# Altium schematic sheet CPU-0.SchDoc
size A3
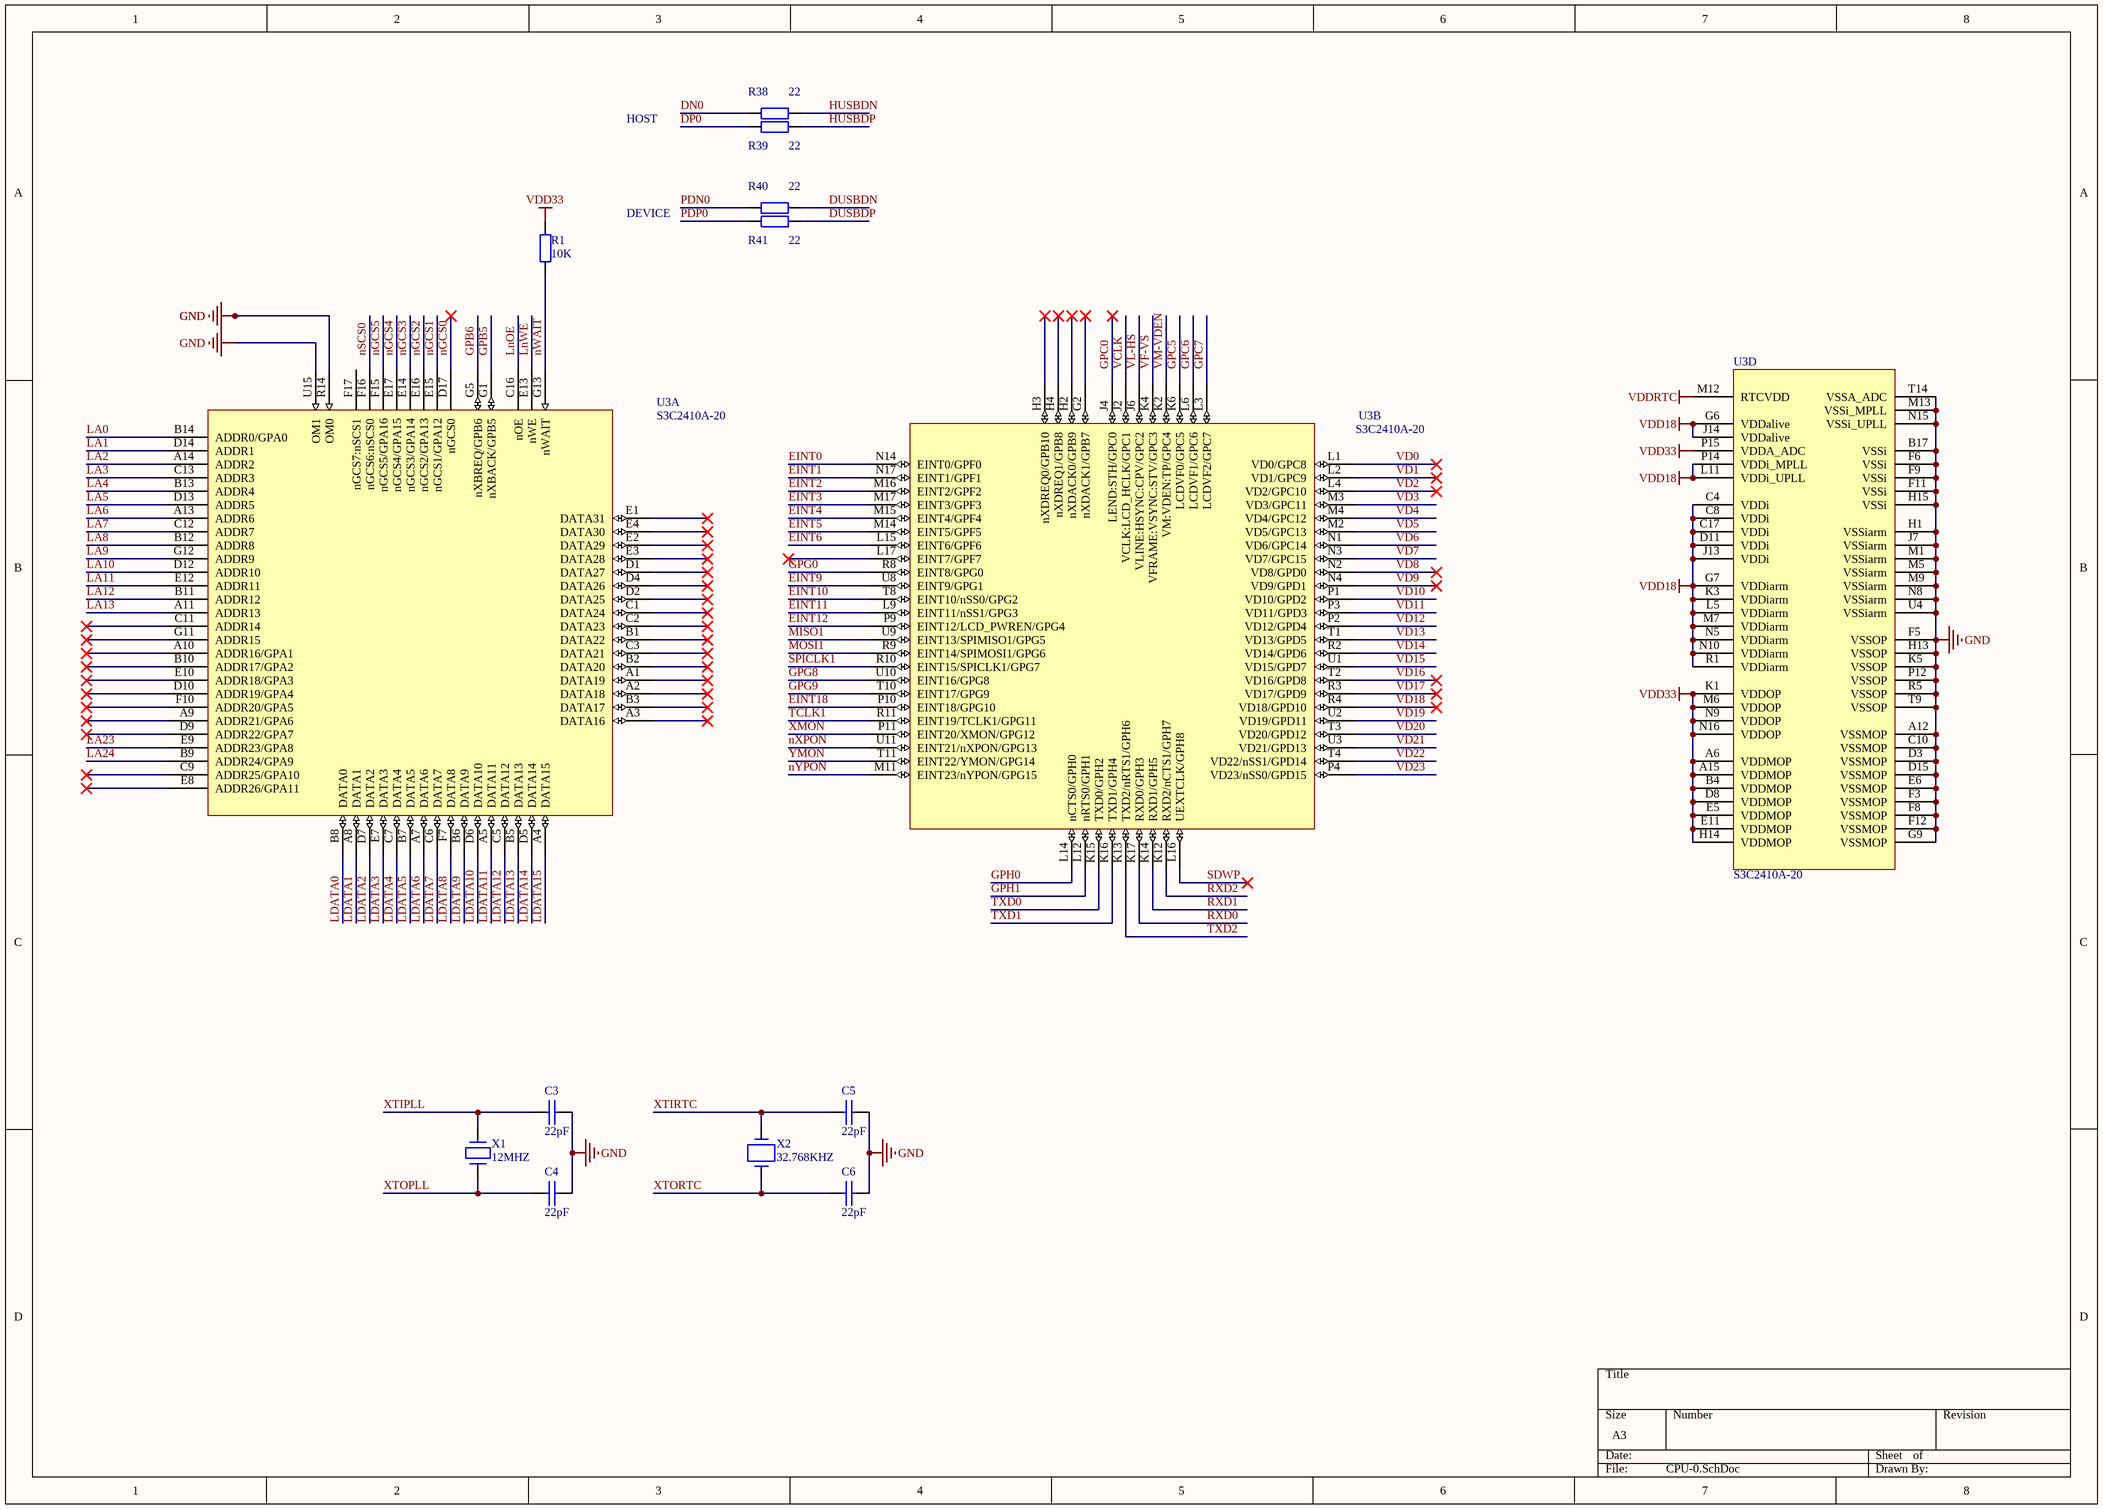
[diagram p0: CPU-0.SchDoc]

## Parts
C3  22pF  [A型钽电容]
C4  22pF  [A型钽电容]
C5  22pF  [A型钽电容]
C6  22pF  [A型钽电容]
R1  value 10K  [0603R]  (hidden comment: Res2)
R38  value 22  [0603R]  (hidden comment: Res2)
R39  value 22  [0603R]  (hidden comment: Res2)
R40  value 22  [0603R]  (hidden comment: Res2)
R41  value 22  [0603R]  (hidden comment: Res2)
U3  S3C2410A-20  [FBGA272]  (parts A,B,D of 4)
X1  12MHZ  [OSC2PR-1]
X2  32.768KHZ  [XTAL-B]

## Nets
GND: C3.2 C4.2 C5.2 C6.2 U3.A12(VSSMOP) U3.B17(VSSi) U3.C10(VSSMOP) U3.D3(VSSMOP) U3.D15(VSSMOP) U3.E6(VSSMOP) U3.F3(VSSMOP) U3.F5(VSSOP) U3.F6(VSSi) U3.F8(VSSMOP) U3.F9(VSSi) U3.F11(VSSi) U3.F12(VSSMOP) U3.G9(VSSMOP) U3.H1(VSSiarm) U3.H13(VSSOP) U3.H15(VSSi) U3.J7(VSSiarm) U3.K5(VSSOP) U3.M1(VSSiarm) U3.M5(VSSiarm) U3.M9(VSSiarm) U3.M13(VSSi_MPLL) U3.N8(VSSiarm) U3.N15(VSSi_UPLL) U3.P12(VSSOP) U3.R5(VSSOP) U3.R14(OM0) U3.T9(VSSOP) U3.T14(VSSA_ADC) U3.U4(VSSiarm) U3.U15(OM1)
VDD18: U3.C4(VDDi) U3.C8(VDDi) U3.C17(VDDi) U3.D11(VDDi) U3.G6(VDDalive) U3.G7(VDDiarm) U3.J13(VDDi) U3.J14(VDDalive) U3.K3(VDDiarm) U3.L5(VDDiarm) U3.L11(VDDi_UPLL) U3.M7(VDDiarm) U3.N5(VDDiarm) U3.N10(VDDiarm) U3.P14(VDDi_MPLL) U3.R1(VDDiarm)
VDD33: R1.2 U3.A6(VDDMOP) U3.A15(VDDMOP) U3.B4(VDDMOP) U3.D8(VDDMOP) U3.E5(VDDMOP) U3.E11(VDDMOP) U3.H14(VDDMOP) U3.K1(VDDOP) U3.M6(VDDOP) U3.N9(VDDOP) U3.N16(VDDOP) U3.P15(VDDA_ADC)
VDDRTC: U3.M12(RTCVDD)
DN0: R38.1
DP0: R39.1
DUSBDN: R40.2
DUSBDP: R41.2
EINT0: U3.N14(EINT0/GPF0)
EINT1: U3.N17(EINT1/GPF1)
EINT2: U3.M16(EINT2/GPF2)
EINT3: U3.M17(EINT3/GPF3)
EINT4: U3.M15(EINT4/GPF4)
EINT5: U3.M14(EINT5/GPF5)
EINT6: U3.L15(EINT6/GPF6)
EINT9: U3.U8(EINT9/GPG1)
EINT10: U3.T8(EINT10/nSS0/GPG2)
EINT11: U3.L9(EINT11/nSS1/GPG3)
EINT12: U3.P9(EINT12/LCD_PWREN/GPG4)
EINT18: U3.P10(EINT18/GPG10)
GPB5: U3.G1(nXBACK/GPB5)
GPB6: U3.G5(nXBREQ/GPB6)
GPC0: U3.J4(LEND:STH/GPC0)
GPC5: U3.K6(LCDVF0/GPC5)
GPC6: U3.L6(LCDVF1/GPC6)
GPC7: U3.L3(LCDVF2/GPC7)
GPG0: U3.R8(EINT8/GPG0)
GPG8: U3.U10(EINT16/GPG8)
GPG9: U3.T10(EINT17/GPG9)
GPH0: U3.L14(nCTS0/GPH0)
GPH1: U3.L12(nRTS0/GPH1)
HUSBDN: R38.2
HUSBDP: R39.2
LA0: U3.B14(ADDR0/GPA0)
LA1: U3.D14(ADDR1)
LA2: U3.A14(ADDR2)
LA3: U3.C13(ADDR3)
LA4: U3.B13(ADDR4)
LA5: U3.D13(ADDR5)
LA6: U3.A13(ADDR6)
LA7: U3.C12(ADDR7)
LA8: U3.B12(ADDR8)
LA9: U3.G12(ADDR9)
LA10: U3.D12(ADDR10)
LA11: U3.E12(ADDR11)
LA12: U3.B11(ADDR12)
LA13: U3.A11(ADDR13)
LA23: U3.E9(ADDR23/GPA8)
LA24: U3.B9(ADDR24/GPA9)
LDATA0: U3.B8(DATA0)
LDATA1: U3.A8(DATA1)
LDATA2: U3.D7(DATA2)
LDATA3: U3.E7(DATA3)
LDATA4: U3.C7(DATA4)
LDATA5: U3.B7(DATA5)
LDATA6: U3.A7(DATA6)
LDATA7: U3.C6(DATA7)
LDATA8: U3.F7(DATA8)
LDATA9: U3.B6(DATA9)
LDATA10: U3.D6(DATA10)
LDATA11: U3.A5(DATA11)
LDATA12: U3.C5(DATA12)
LDATA13: U3.B5(DATA13)
LDATA14: U3.D5(DATA14)
LDATA15: U3.A4(DATA15)
LnOE: U3.C16(nOE)
LnWE: U3.E13(nWE)
MISO1: U3.U9(EINT13/SPIMISO1/GPG5)
MOSI1: U3.R9(EINT14/SPIMOSI1/GPG6)
nGCS0: U3.D17(nGCS0)
nGCS1: U3.E15(nGCS1/GPA12)
nGCS2: U3.E16(nGCS2/GPA13)
nGCS3: U3.E14(nGCS3/GPA14)
nGCS4: U3.E17(nGCS4/GPA15)
nGCS5: U3.F15(nGCS5/GPA16)
nSCS0: U3.F16(nGCS6:nSCS0)
nWAIT: R1.1 U3.G13(nWAIT)
nXPON: U3.U11(EINT21/nXPON/GPG13)
nYPON: U3.M11(EINT23/nYPON/GPG15)
PDN0: R40.1
PDP0: R41.1
RXD0: U3.K17(RXD0/GPH3)
RXD1: U3.K14(RXD1/GPH5)
RXD2: U3.K12(RXD2/nCTS1/GPH7)
SDWP: U3.L16(UEXTCLK/GPH8)
SPICLK1: U3.R10(EINT15/SPICLK1/GPG7)
TCLK1: U3.R11(EINT19/TCLK1/GPG11)
TXD0: U3.K15(TXD0/GPH2)
TXD1: U3.K16(TXD1/GPH4)
TXD2: U3.K13(TXD2/nRTS1/GPH6)
VCLK: U3.J2(VCLK:LCD_HCLK/GPC1)
VD0: U3.L1(VD0/GPC8)
VD1: U3.L2(VD1/GPC9)
VD2: U3.L4(VD2/GPC10)
VD3: U3.M3(VD3/GPC11)
VD4: U3.M4(VD4/GPC12)
VD5: U3.M2(VD5/GPC13)
VD6: U3.N1(VD6/GPC14)
VD7: U3.N3(VD7/GPC15)
VD8: U3.N2(VD8/GPD0)
VD9: U3.N4(VD9/GPD1)
VD10: U3.P1(VD10/GPD2)
VD11: U3.P3(VD11/GPD3)
VD12: U3.P2(VD12/GPD4)
VD13: U3.T1(VD13/GPD5)
VD14: U3.R2(VD14/GPD6)
VD15: U3.U1(VD15/GPD7)
VD16: U3.T2(VD16/GPD8)
VD17: U3.R3(VD17/GPD9)
VD18: U3.R4(VD18/GPD10)
VD19: U3.U2(VD19/GPD11)
VD20: U3.T3(VD20/GPD12)
VD21: U3.U3(VD21/GPD13)
VD22: U3.T4(VD22/nSS1/GPD14)
VD23: U3.P4(VD23/nSS0/GPD15)
VF-VS: U3.K4(VFRAME:VSYNC:STV/GPC3)
VL-HS: U3.J6(VLINE:HSYNC:CPV/GPC2)
VM-VDEN: U3.K2(VM:VDEN:TP/GPC4)
XMON: U3.P11(EINT20/XMON/GPG12)
XTIPLL: C3.1 X1.2
XTIRTC: C5.1 X2.2
XTOPLL: C4.1 X1.1
XTORTC: C6.1 X2.1
YMON: U3.T11(EINT22/YMON/GPG14)

Not connected (* = marked no-connect by the designer): U3 A1(DATA19)* A2(DATA18)* A3(DATA16)* A9(ADDR21/GPA6)* A10(ADDR16/GPA1)* B1(DATA22)* B2(DATA20)* B3(DATA17)* B10(ADDR17/GPA2)* C1(DATA24)* C2(DATA23)* C3(DATA21)* C9(ADDR25/GPA10)* C11(ADDR14)* D1(DATA27)* D2(DATA25)* D4(DATA26)* D9(ADDR22/GPA7)* D10(ADDR19/GPA4)* E1(DATA31)* E2(DATA29)* E3(DATA28)* E4(DATA30)* E8(ADDR26/GPA11)* E10(ADDR18/GPA3)* F10(ADDR20/GPA5)* F17(nGCS7:nSCS1) G2(nXDACK1/GPB7)* G11(ADDR15)* H2(nXDACK0/GPB9)* H3(nXDREQ0/GPB10)* H4(nXDREQ1/GPB8)* L17(EINT7/GPF7)*

## Notes on the sheet
- HOST
- DEVICE

## Library data of the parts
C3-C6 = CAP_1: Capacitor
R1 R38-R41 = Res2_1: Resistor; Published: 8-Jun-2000; LatestRevisionDate: 17-Jul-2002; LatestRevisionNote: Re-released for DXP Platform.; PackageReference: AXIAL-0.4; Publisher: Altium Limited
U3 = S3C2410A-20: 32-Bit RISC Microprocessor, 200 MHz, 1.8V (Core), 3.3V (Memory and IO), 272-Pin FBGA; Published: 6-Oct-2005; LatestRevisionDate: 13-Apr-2006; LatestRevisionNote: IPC-7351 Footprint Added.; DatasheetVersion: rev1.0, Mar-2004; PackageVersion: Mar-2004; PackageReference: FBGA272; Publisher: Altium Limited; PackageDescription: 272-Ball Ball Grid Array 0.8 mm Pitch; ComponentLink1Description: Manufacturer Link; ComponentLink1URL: http://www.samsung.com; ComponentLink2Description: Datasheet; ComponentLink2URL: http://www.samsung.com/Products/Semiconductor/SystemLSI/MobileSolutions/MobileASSP/MobileComputing/S3C2410/um_s3c2410a_manual_r10.pdf
X1 = CRYSTAL: Part Field 1: 1; Part Field 5: 1; Part Field 6: 1000K
X2 = CRYSTAL_1: Text Field1: 20; Text Field2: 20